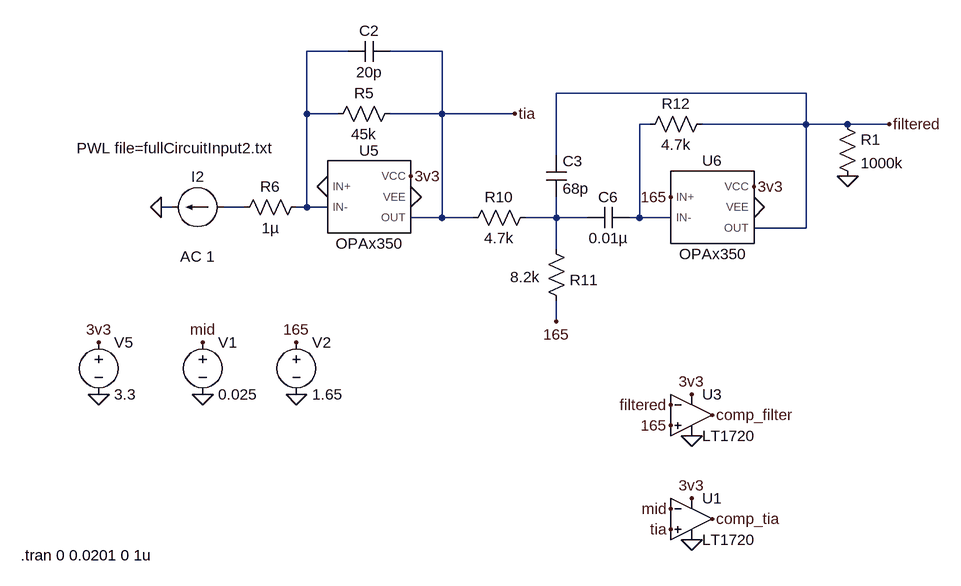
[diagram p0: schematic circuit_filter2.asc]
circuit_filter2.asc, the LTspice schematic file:
Version 4.1
SHEET 1 1996 1744
WIRE 0 800 -64 800
WIRE 144 800 64 800
WIRE 704 864 320 864
WIRE -64 896 -64 800
WIRE -16 896 -64 896
WIRE 144 896 144 800
WIRE 144 896 64 896
WIRE 256 896 144 896
WIRE 464 912 448 912
WIRE 704 912 704 864
WIRE 704 912 544 912
WIRE 768 912 704 912
WIRE 832 912 768 912
WIRE 320 960 320 864
WIRE -272 1040 -288 1040
WIRE -160 1040 -192 1040
WIRE -64 1040 -64 896
WIRE -64 1040 -80 1040
WIRE -32 1040 -64 1040
WIRE 144 1056 144 896
WIRE 144 1056 96 1056
WIRE 192 1056 144 1056
WIRE 320 1056 320 1024
WIRE 320 1056 272 1056
WIRE 368 1056 320 1056
WIRE 448 1056 448 912
WIRE 448 1056 432 1056
WIRE 496 1056 448 1056
WIRE 704 1072 704 912
WIRE 704 1072 624 1072
WIRE 320 1104 320 1056
WIRE 320 1216 320 1184
FLAG 96 992 3v3
FLAG 96 1024 0
FLAG -288 1040 0
FLAG 624 1008 3v3
FLAG 624 1040 0
FLAG 832 912 filtered
FLAG -384 1328 0
FLAG -384 1248 3v3
FLAG 320 1216 165
FLAG 496 1024 165
FLAG 496 1344 filtered
FLAG 560 1360 comp_filter
FLAG -32 1008 0
FLAG 496 1376 165
FLAG 528 1328 3v3
FLAG 528 1392 0
FLAG 560 1520 comp_tia
FLAG 528 1488 3v3
FLAG 528 1552 0
FLAG 496 1504 mid
FLAG 256 896 tia
FLAG 496 1536 tia
FLAG -224 1328 0
FLAG -80 1328 0
FLAG -224 1248 mid
FLAG -80 1248 165
FLAG 768 992 0
SYMBOL res 80 880 R90
WINDOW 0 0 56 VBottom 2
WINDOW 3 32 56 VTop 2
SYMATTR InstName R5
SYMATTR Value 45k
SYMBOL cap 64 784 R90
WINDOW 0 0 32 VBottom 2
WINDOW 3 32 32 VTop 2
SYMATTR InstName C2
SYMATTR Value 20p
SYMBOL res -64 1024 R90
WINDOW 0 0 56 VBottom 2
WINDOW 3 32 56 VTop 2
SYMATTR InstName R6
SYMATTR Value 1µ
SYMBOL current -192 1040 R90
WINDOW 0 -32 40 VBottom 2
WINDOW 3 -107 75 VTop 2
WINDOW 123 60 40 VTop 2
WINDOW 39 0 0 Left 0
SYMATTR InstName I2
SYMATTR Value PWL file=fullCircuitInput2.txt
SYMATTR Value2 AC 1
SYMBOL res 288 1040 R90
WINDOW 0 0 56 VBottom 2
WINDOW 3 32 56 VTop 2
SYMATTR InstName R10
SYMATTR Value 4.7k
SYMBOL res 336 1200 R180
WINDOW 0 -49 48 Left 2
WINDOW 3 41 53 Left 2
SYMATTR InstName R11
SYMATTR Value 8.2k
SYMBOL cap 304 960 R0
WINDOW 0 26 9 Left 2
WINDOW 3 26 51 Left 2
SYMATTR InstName C3
SYMATTR Value 68p
SYMBOL cap 432 1040 R90
WINDOW 0 0 32 VBottom 2
WINDOW 3 32 32 VTop 2
SYMATTR InstName C6
SYMATTR Value 0.01µ
SYMBOL res 560 896 R90
WINDOW 0 0 56 VBottom 2
WINDOW 3 32 56 VTop 2
SYMATTR InstName R12
SYMATTR Value 4.7k
SYMBOL voltage -384 1232 R0
WINDOW 123 0 0 Left 0
WINDOW 39 0 0 Left 0
SYMATTR InstName V5
SYMATTR Value 3.3
SYMBOL Comparators\\LT1720 528 1296 R0
SYMATTR InstName U3
SYMBOL Comparators\\LT1720 528 1456 R0
SYMATTR InstName U1
SYMBOL LTSpiceModels\\sbom071e\\OPAx350 32 1024 R0
SYMATTR InstName U5
SYMBOL LTSpiceModels\\sbom071e\\OPAx350 560 1040 R0
SYMATTR InstName U6
SYMBOL voltage -224 1232 R0
WINDOW 123 0 0 Left 0
WINDOW 39 0 0 Left 0
SYMATTR InstName V1
SYMATTR Value 0.025
SYMBOL voltage -80 1232 R0
WINDOW 123 0 0 Left 0
WINDOW 39 0 0 Left 0
SYMATTR InstName V2
SYMATTR Value 1.65
SYMBOL res 752 896 R0
SYMATTR InstName R1
SYMATTR Value 1000k
TEXT -504 1576 Left 2 !.tran 0 0.0201 0 1u

The netlist it stands for:
* circuit_filter2.asc
R5 tia N001 45k
C2 tia N001 20p
R6 N001 N003 1µ
I2 N003 0 PWL file=fullCircuitInput2.txt AC 1
R10 N004 tia 4.7k
R11 165 N004 8.2k
C3 filtered N004 68p
C6 N002 N004 0.01µ
R12 filtered N002 4.7k
V5 3v3 0 3.3
X§U3 165 filtered 3v3 0 comp_filter LT1720  ; pins In+ In- V+ V- OUT
X§U1 tia mid 3v3 0 comp_tia LT1720  ; pins In+ In- V+ V- OUT
X§U5 0 N001 3v3 0 tia OPAx350  ; pins IN+ IN- VCC VEE OUT
X§U6 165 N002 3v3 0 filtered OPAx350  ; pins IN+ IN- VCC VEE OUT
V1 mid 0 0.025
V2 165 0 1.65
R1 filtered 0 1000k
.tran 0 0.0201 0 1u
.lib LT1720.sub
.lib C:\Users\jpulu\OneDrive\Área de Trabalho\TCC\LTSpiceModels\sbom071e\OPAx350.LIB
.backanno
.end